# EAGLE design Thermostat (EAGLE 5.04)
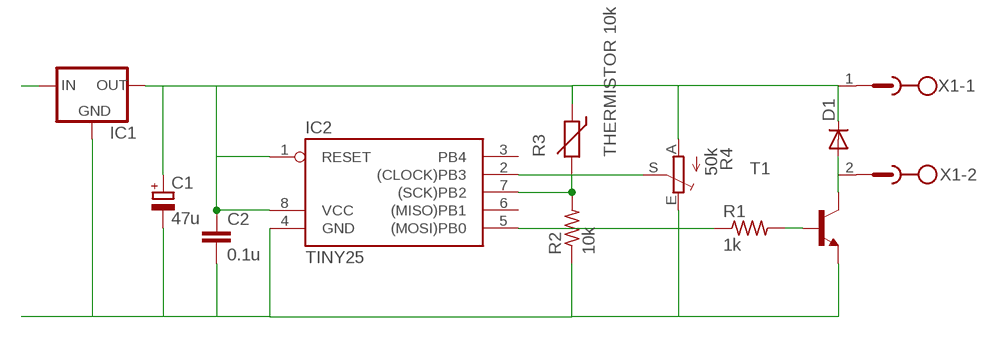
[diagram p0: schematic, sheet 1]

## Parts
C1  47u  CPOL-EUE2-4  [E2-4]
C2  0.1u  C-EU025-024X044  [C025-024X044]
D1  1N4148DO35-7  [DO35-7]
IC1  78XXS  [78XXS]
IC2  TINY25  TINY22P  [DIL08]
R1  1k  R-US_0207/2V  [0207/2V]
R2  10k  R-US_0204/7  [0204/7]
R3  THERMISTOR 10k  THERMISTOR-2,5  [RS-2,5]
R4  50k  TRIM_EU-B25P  [B25P]
T1  BC337-16-NPN-TO92-EBC  [TO92-EBC]
X1  MSTBV2  [MSTBV2]

## Nets
N$1: IC2.5((MOSI)PB0) R1.1
N$2: R1.2 T1.B
N$3: D1.A T1.C X1.2
N$4: C1.+ C2.1 D1.C IC1.OUT IC2.1(RESET) IC2.8(VCC) R3.1 R4.A X1.1
N$5: IC2.7((SCK)PB2) R2.2 R3.2
N$6: IC2.2((CLOCK)PB3) R4.S
N$7: IC1.IN
N$8: C1.- C2.2 IC1.GND IC2.4(GND) R2.1 R4.E T1.E
Unconnected: IC2.3(PB4) IC2.6((MISO)PB1)

## Library data of the parts
C1 = resistor:CPOL-EU: POLARIZED CAPACITOR, European symbol
C2 = resistor:C-EU: CAPACITOR, European symbol
D1 = diode:1N4148: DIODE high speed (Philips)
IC1 = v-reg:78XXS: VOLTAGE REGULATOR
IC2 = atmel:TINY22: MICROCONTROLLER 1K ROM 128 bytes RAM 128 bytes EEPROM
R1 R2 = resistor:R-US_: RESISTOR, American symbol
R3 = varistor:THERMISTOR: THERMISTOR
R4 = pot:TRIM_EU-: POTENTIOMETER
T1 = transistor:*-NPN-: NPN Transistror BF959 corrected 2008.03.06
X1 = con-phoenix-500:MSTBV2: PHOENIX

## Board
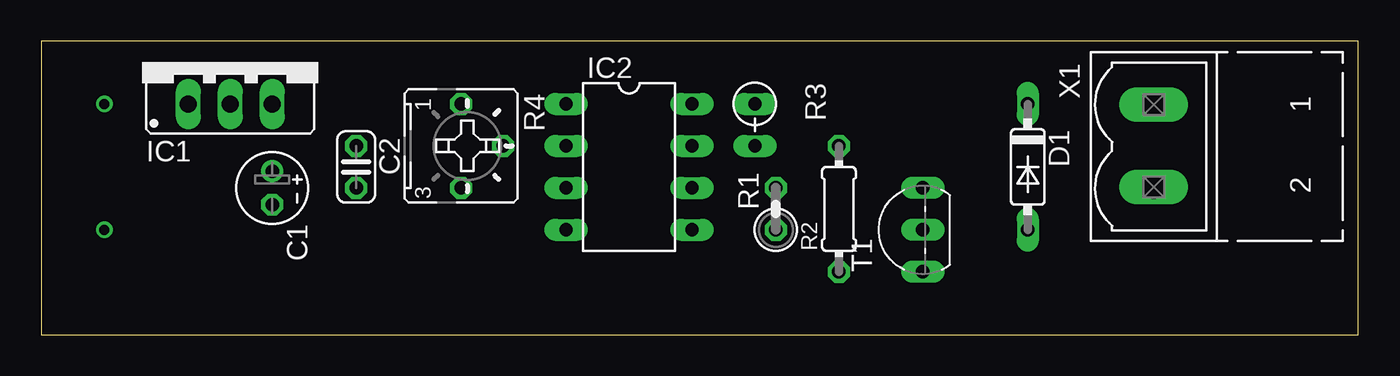
[diagram p1: board, top side]
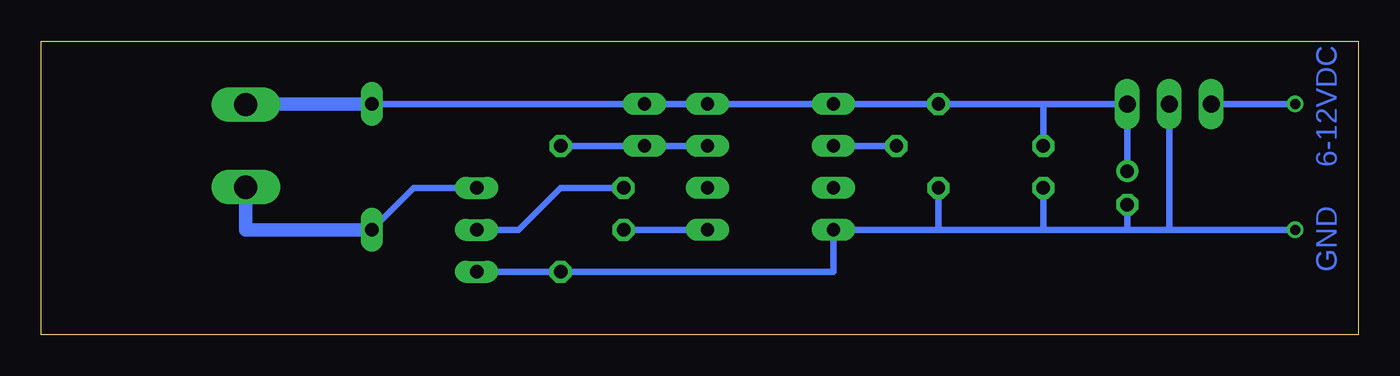
[diagram p2: board, bottom side, seen from below]

Size 79.68 x 17.77 mm. Coordinates in mm from the lower left corner, seen from the top.
Outline: 0,0 79.68,0 79.68,17.77 0,17.77 0,0
Copper layers (1*16): Top 0.035mm / dielectric 1.5mm / Bottom 0.035mm
Design rules "default": minimum track width 10mil, minimum drill 24mil, track to track 8mil, track to pad 8mil, pad to pad 8mil, via to via 8mil, smd to smd 8mil, copper to edge 40mil, drill to drill 8mil, minimum pad ring 10mil, minimum via ring 8mil, stop-mask expansion 4mil, vias tented up to drill 0mil, thermal gap 10mil

### Footprints (pad centres in the part's own frame; a part is rotated, then mirrored left to right if it is on the bottom)
E2-4 = drill 0.813 pad 1.27 round: + -1.016,0 | drill 0.813 pad 1.27 octagon: - 1.016,0
C025-024X044 = drill 0.813 octagon: 1 -1.27,0; 2 1.27,0
DO35-7 = drill 0.813 long: A 3.81,0; C -3.81,0
78XXS = drill 1.016 long: GND 0,-2.54; IN -2.54,-2.54; OUT 2.54,-2.54
DIL08 = drill 0.813 long: 1 -3.81,-3.81; 2 -1.27,-3.81; 3 1.27,-3.81; 4 3.81,-3.81; 5 3.81,3.81; 6 1.27,3.81; 7 -1.27,3.81; 8 -3.81,3.81
0207/2V = drill 0.813 octagon: 1 -1.27,0; 2 1.27,0
0204/7 = drill 0.813 octagon: 1 -3.81,0; 2 3.81,0
RS-2,5 = drill 0.813 long: 1 -1.27,0; 2 1.27,0
B25P = drill 0.813 octagon: A -2.54,0; E 2.54,0; S 0,2.54
TO92-EBC = drill 0.813 long: B 0,-1.27; C 2.54,-1.27; E -2.54,-1.27
MSTBV2 = drill 1.397 long: 1 -2.5,0; 2 2.5,0

### Placement (x,y rotation side)
C1  13.97,8.89 270 top
C2  19.05,10.16 270 top
D1  59.69,10.16 270 top
IC1  11.43,16.51 0 top
IC2  35.56,10.16 270 top
R1  44.45,7.62 90 top
R2  48.26,7.62 90 top
R3  43.18,12.7 270 top
R4  25.4,11.43 270 top
T1  52.07,6.35 90 top
X1  67.31,11.43 270 top

### Tracks (layer width: path | path; a pad name or v marks a point on that pad's centre or on a via)
N$1
  Bottom 0.406: IC2.5 R1.1
N$2
  Bottom 0.406: R1.2 48.26,8.89 50.8,6.35 T1.B
N$3
  Bottom 0.406: T1.C 57.15,8.89 D1.A
  Bottom 0.813: D1.A 67.31,6.35 X1.2
N$4
  Bottom 0.406: 19.05,13.97 IC1.OUT C1.+ | 19.05,13.97 IC2.1 IC2.8 R3.1 D1.C | 19.05,13.97 C2.1 | 19.05,13.97 R4.A
  Bottom 0.813: D1.C 66.04,13.97 X1.1
N$5
  Bottom 0.406: R2.2 R3.2 IC2.7
N$6
  Bottom 0.406: R4.S IC2.2
N$7  (via drill 0.6)
  Bottom 0.406: v3.81,13.97 IC1.IN
N$8  (via drill 0.6)
  Bottom 0.406: 11.43,6.35 IC1.GND | 11.43,6.35 13.97,6.35 | 13.97,6.35 C1.- | 13.97,6.35 19.05,6.35 | 19.05,6.35 C2.2 | 19.05,6.35 25.4,6.35 | 25.4,6.35 IC2.4 31.75,3.81 R2.1 T1.E | v3.81,6.35 11.43,6.35 | 25.4,6.35 R4.E

### Text on the board
Bottom: 6-12VDC | GND